# Altium schematic sheet main_io.SchDoc: Main IO
size A4; Organization: Badgerloop Electrical; Address1: 133 Engineering Research Building; Address2: 1500 Engineering Drive; Address3: Madison, Wi 53706
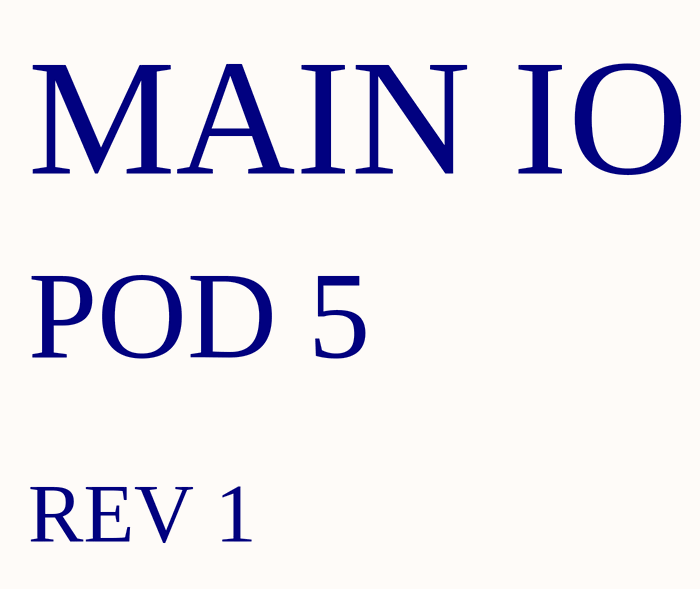
[diagram p0: main_io.SchDoc]

## Notes on the sheet
- MAIN IO
- POD 5
- REV 1
- Title
- Engineer:
- Date:
- Time:
- Revision:
- Sheet
- of
- File: